# EAGLE design StepDrv (EAGLE 7.2.0)
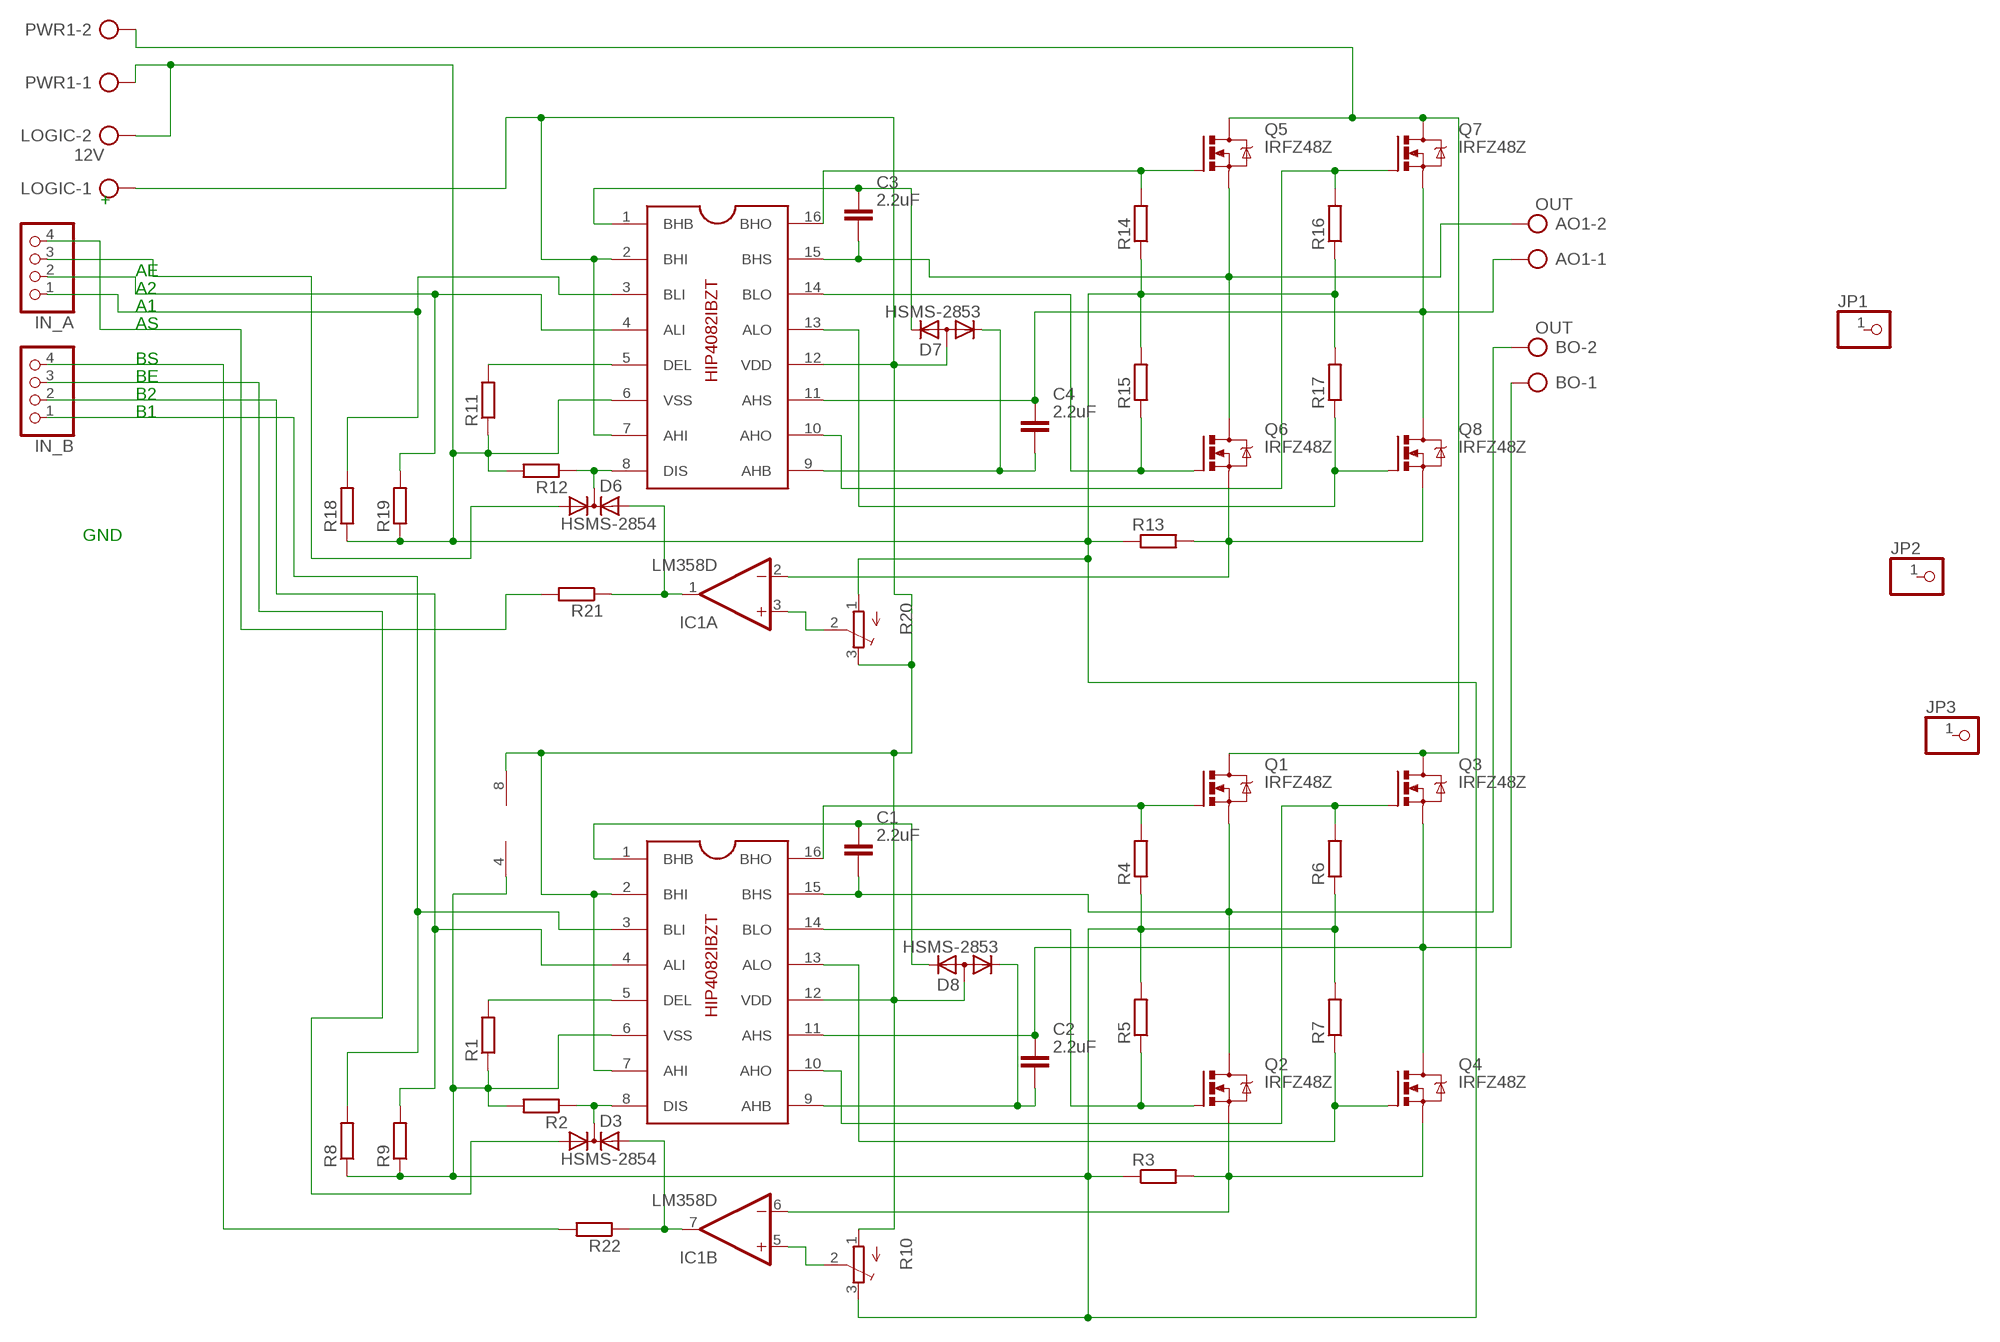
[diagram p0: schematic, sheet 1]

## Parts
AO1  OUT  AK300/2  [AK300/2]
BO  OUT  AK300/2  [AK300/2]
C1  2.2uF  CAPACITOR_NPOL-1206  [C1206]
C2  2.2uF  CAPACITOR_NPOL-1206  [C1206]
C3  2.2uF  CAPACITOR_NPOL-1206  [C1206]
C4  2.2uF  CAPACITOR_NPOL-1206  [C1206]
D3  HSMS-2854  [SOT23]
D6  HSMS-2854  [SOT23]
D7  HSMS-2853  [SOT23]
D8  HSMS-2853  [SOT23]
IC1  LM358D  [SO08]
IN_A  PINHD-1X4  [1X04]
IN_B  PINHD-1X4  [1X04]
JP1  PINHD-1X1  [1X01]
JP2  PINHD-1X1  [1X01]
JP3  PINHD-1X1  [1X01]
LOGIC  12V  AK300/2  [AK300/2]
PWR1  AK300/2  [AK300/2]
Q1  IRFZ48Z  [TO220BH]
Q2  IRFZ48Z  [TO220BH]
Q3  IRFZ48Z  [TO220BH]
Q4  IRFZ48Z  [TO220BH]
Q5  IRFZ48Z  [TO220BH]
Q6  IRFZ48Z  [TO220BH]
Q7  IRFZ48Z  [TO220BH]
Q8  IRFZ48Z  [TO220BH]
R1  R-EU_R1206  [R1206]
R2  R-EU_R1206  [R1206]
R3  R-EU_0922/22  [0922/22]
R4  R-EU_M1206  [M1206]
R5  R-EU_M1206  [M1206]
R6  R-EU_M1206  [M1206]
R7  R-EU_M1206  [M1206]
R8  R-EU_M1206  [M1206]
R9  R-EU_M1206  [M1206]
R10  TRIM_EU-3223G  [3223G]
R11  R-EU_R1206  [R1206]
R12  R-EU_R1206  [R1206]
R13  R-EU_0922/22  [0922/22]
R14  R-EU_M1206  [M1206]
R15  R-EU_M1206  [M1206]
R16  R-EU_M1206  [M1206]
R17  R-EU_M1206  [M1206]
R18  R-EU_M1206  [M1206]
R19  R-EU_M1206  [M1206]
R20  TRIM_EU-3223G  [3223G]
R21  R-EU_M1206  [M1206]
R22  R-EU_M1206  [M1206]
U$1  HIP4082IBZT  [SO16]
U$2  HIP4082IBZT  [SO16]

## Nets
N$2: D3.3(C) R2.1 U$1.8(DIS)
N$3: C1.1 D8.2(K2) U$1.1(BHB)
N$4: BO.2 C1.2 Q1.S Q2.D U$1.15(BHS)
N$5: D3.1(A1) IN_B.3
N$6: R1.2 U$1.5(DEL)
N$7: IN_A.4 R21.2
N$8: BO.1 C2.1 Q3.S Q4.D U$1.11(AHS)
N$9: IN_B.2 R9.2 U$1.4(ALI)
N$10: IN_B.1 R8.2 U$1.3(BLI)
N$11: IC1.6(B:-IN) Q2.S Q4.S R3.2
N$12: Q1.G R4.2 U$1.16(BHO)
N$13: Q2.G R5.1 U$1.14(BLO)
N$14: Q3.G R6.2 U$1.10(AHO)
N$15: Q4.G R7.1 U$1.13(ALO)
N$16: D3.2(A2) IC1.7(B:OUT) R22.1
N$18: IC1.5(B:+IN) R10.2(S)
N$19: C4.2 D7.1(K1) U$2.9(AHB)
N$20: C3.1 D7.2(K2) U$2.1(BHB)
N$21: AO1.2 C3.2 Q5.S Q6.D U$2.15(BHS)
N$22: C2.2 D8.1(K1) U$1.9(AHB)
N$23: D6.1(A1) IN_A.3
N$24: R11.2 U$2.5(DEL)
N$25: AO1.1 C4.1 Q7.S Q8.D U$2.11(AHS)
N$26: IC1.2(A:-IN) Q6.S Q8.S R13.2
N$27: Q5.G R14.2 U$2.16(BHO)
N$28: Q6.G R15.1 U$2.14(BLO)
N$29: Q7.G R16.2 U$2.10(AHO)
N$30: Q8.G R17.1 U$2.13(ALO)
N$31: IN_A.2 R19.2 U$2.4(ALI)
N$32: IN_A.1 R18.2 U$2.3(BLI)
N$33: IN_B.4 R22.2
N$34: D6.3(C) R12.1 U$2.8(DIS)
N$35: D6.2(A2) IC1.1(A:OUT) R21.1
N$36: IC1.3(A:+IN) R20.2(S)
N$37: PWR1.2 Q1.D Q3.D Q5.D Q7.D
N$38: IC1.4(P:V-) LOGIC.2 PWR1.1 R1.1 R2.2 R3.1 R4.1 R5.2 R6.1 R7.2 R8.1 R9.1 R10.3(E) R11.1 R12.2 R13.1 R14.1 R15.2 R16.1 R17.2 R18.1 R19.1 R20.1(A) U$1.6(VSS) U$2.6(VSS)
N$39: D7.3(A) D8.3(A) IC1.8(P:V+) LOGIC.1 R10.1(A) R20.3(E) U$1.2(BHI) U$1.7(AHI) U$1.12(VDD) U$2.2(BHI) U$2.7(AHI) U$2.12(VDD)
Unconnected: JP1.1 JP2.1 JP3.1

## Notes on the sheet
- +
- AE
- A2
- A1
- AS
- BS
- BE
- B2
- B1
- GND

## Library data of the parts
AO1 BO LOGIC PWR1 = con-ptr500:AK300/2: CONNECTOR; OC_FARNELL: unknown; OC_NEWARK: unknown
C1-C4 = dp_devices:CAPACITOR_NPOL: Non-Polarized capacitor in various packages
D3 D6 = avago:HSMS-2854: Surface Mount Microwave Schottky Detector Diodes Source: Data sheet <http://www.farnell.com/datasheets/461166.pdf>
D7 D8 = avago:HSMS-2853: Surface Mount Microwave Schottky Detector Diodes Source: Data sheet <http://www.farnell.com/datasheets/461166.pdf>
IC1 = linear:LM358: OP AMP also LM158; LM258; LM2904 Source: http://cache.national.com/ds/LM/LM158.pdf
IN_A IN_B = pinhead:PINHD-1X4: PIN HEADER
JP1-JP3 = pinhead:PINHD-1X1: PIN HEADER
Q1-Q8 = transistor-power:IRFZ48: N Channel HEXFET® Power MOSFET Logic Level Source: http://www.irf.com/product-info/datasheets/data/irfz48z.pdf
R1-R9 R11-R19 R21 R22 = rcl:R-EU_: RESISTOR, European symbol
R10 R20 = pot:TRIM_EU-: POTENTIOMETER
U$1 U$2 = mosfet_drivers:HIP4082IBZT: HIP4082IBZT Тип драйвера сдвоенный драйвер полумоста Время задержки, нс 75 Диапазон рабочих напряжений, В 10…20 Диапазон рабочих температур, С -55…+125 Тип входа неинвертирующий Количество нижних каналов 2 Количество верхних каналов 2 Максимальное напряжение смещения, В 95 Максимальный выходной ток нарастания/спада 1.4/1.4 Корпус so16

## Board
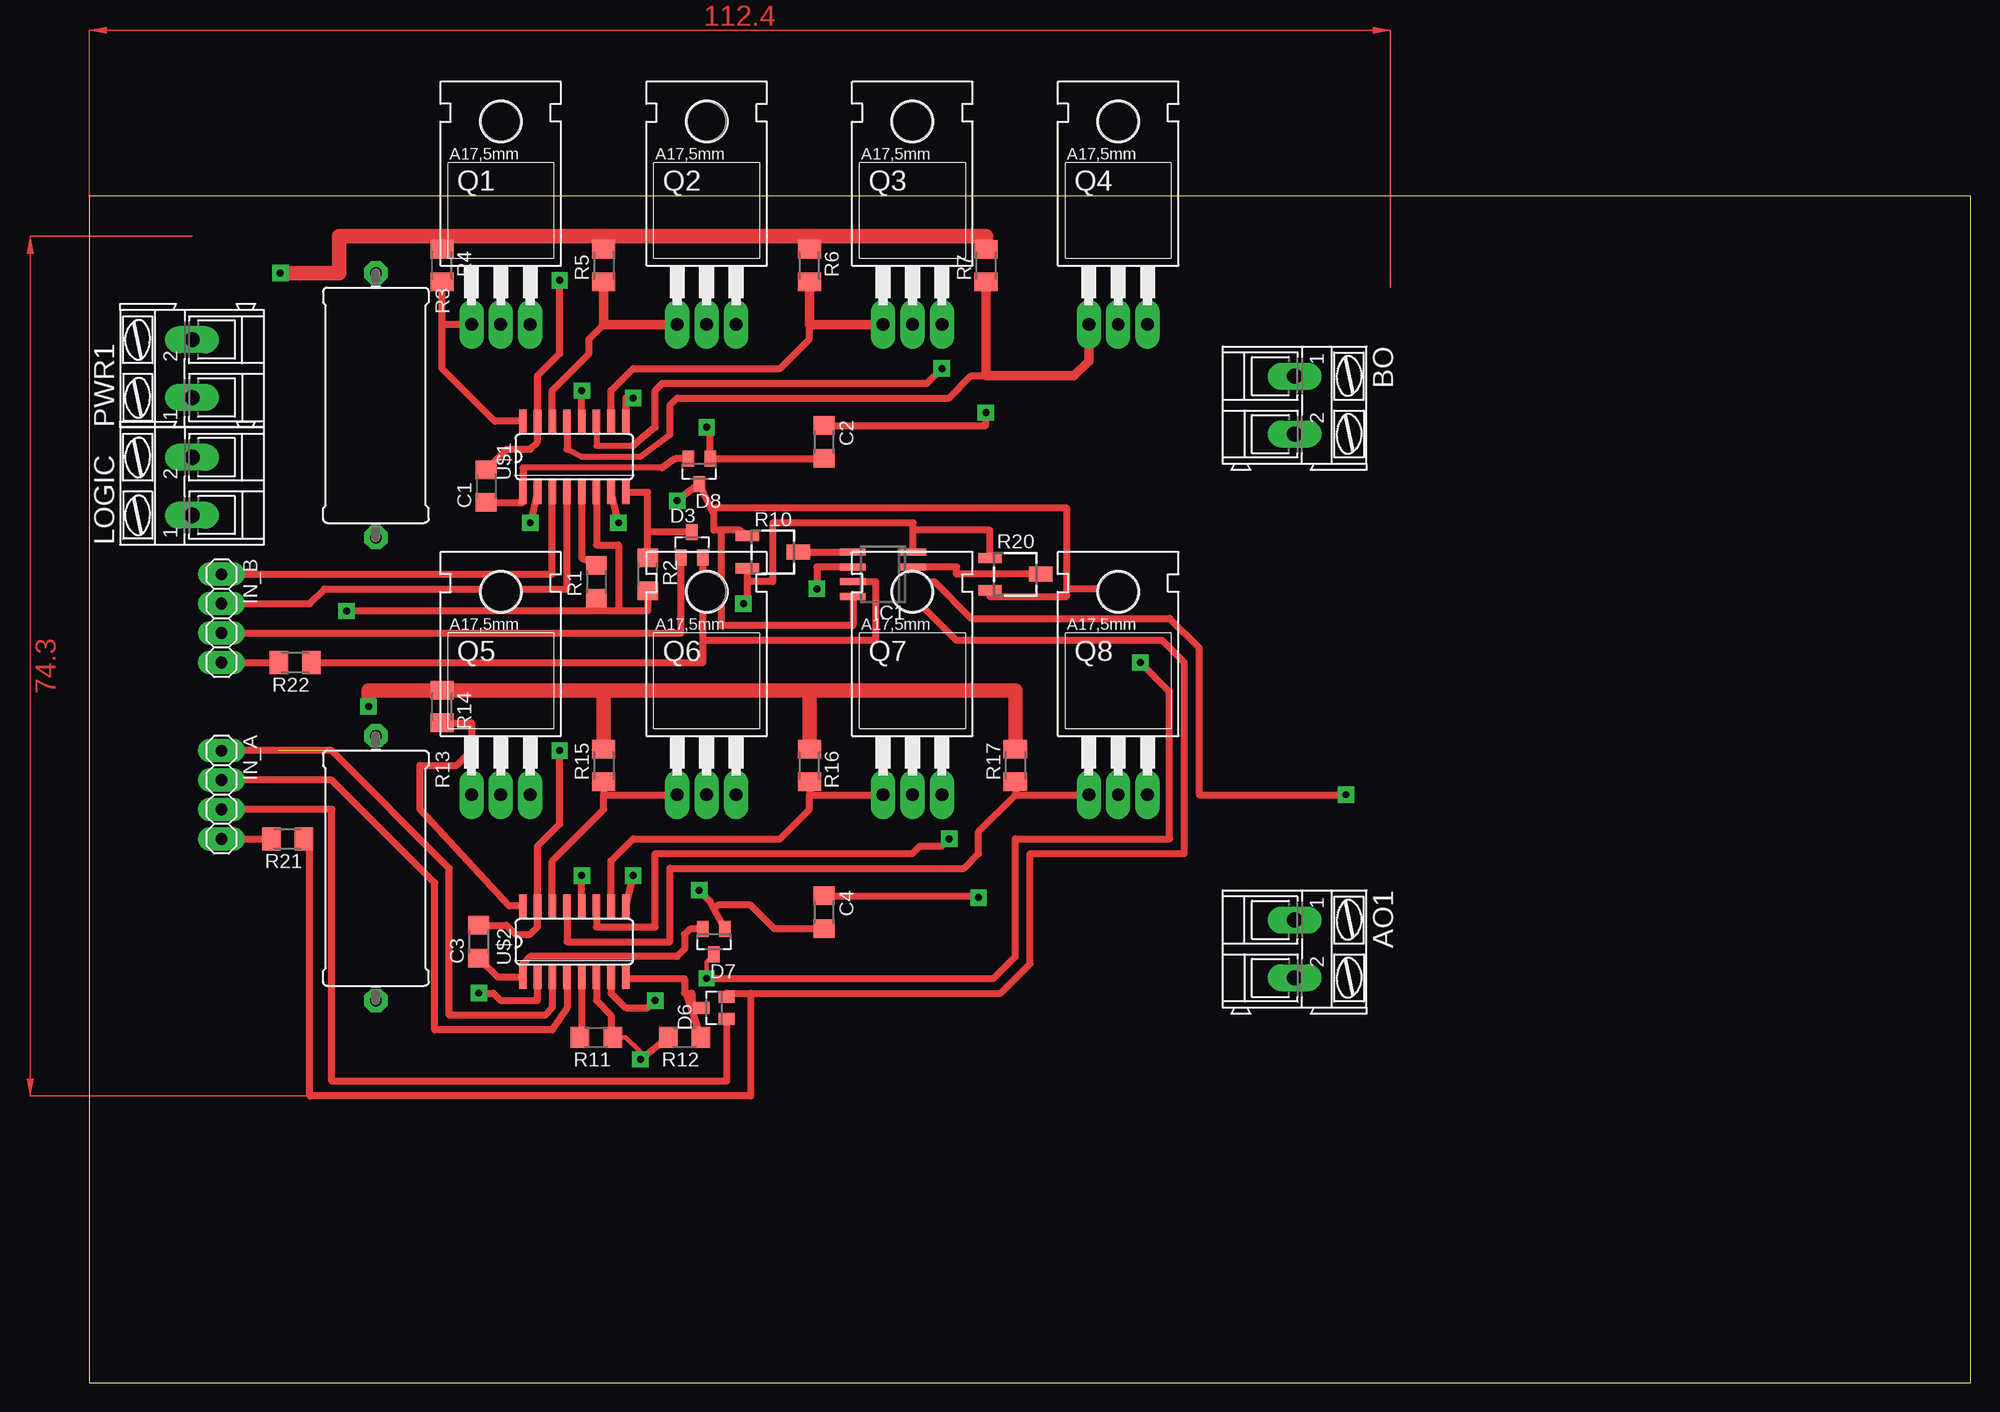
[diagram p1: board, top side]
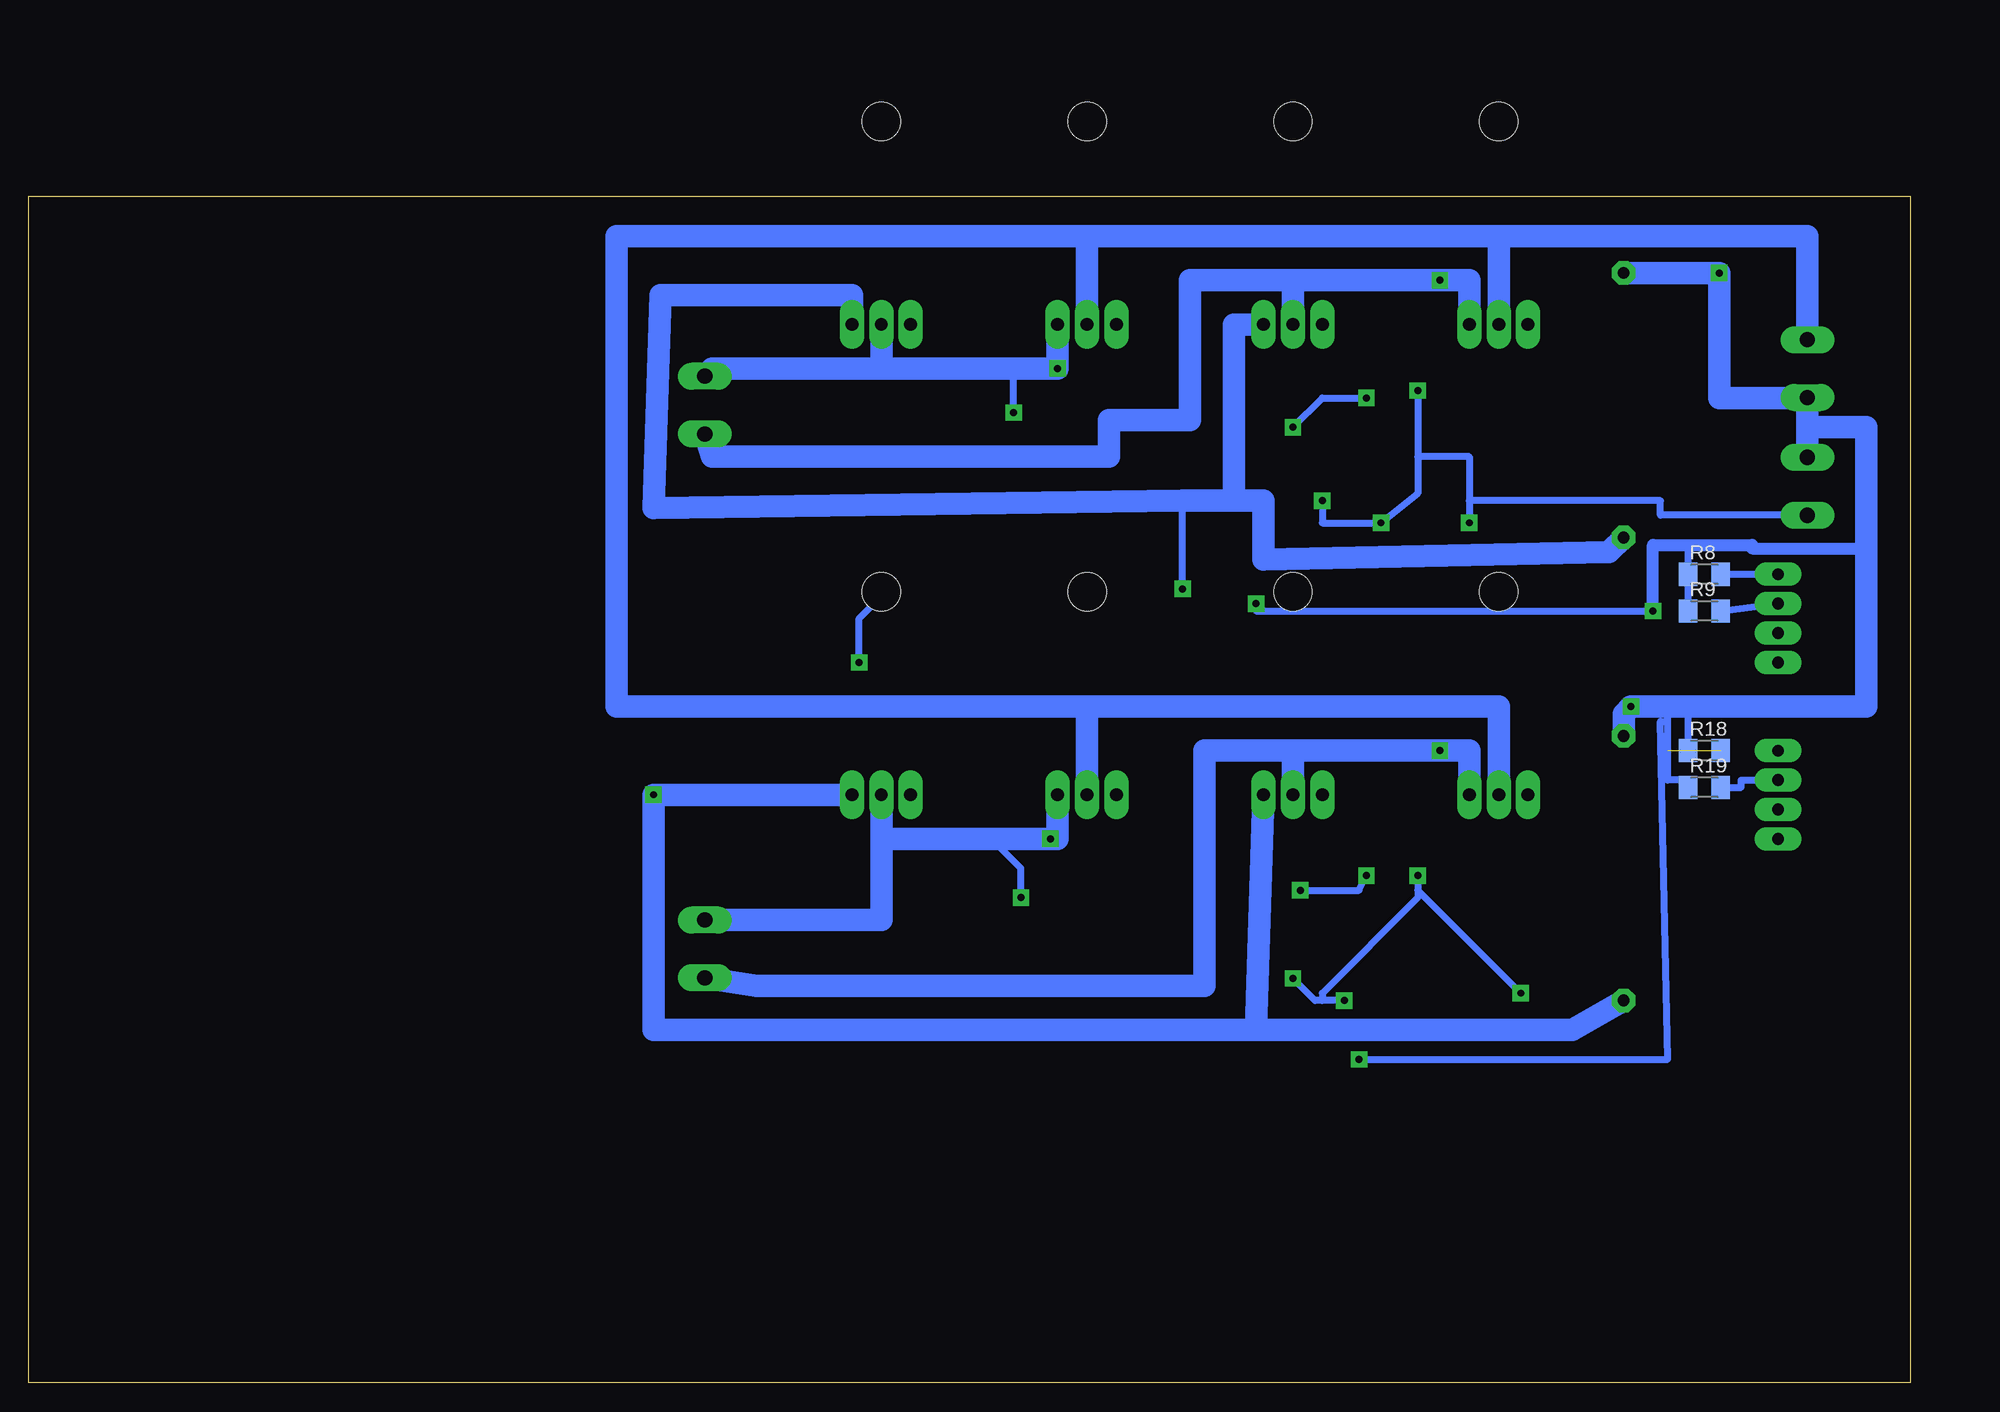
[diagram p2: board, bottom side, seen from below]

Size 162.54 x 102.54 mm. Coordinates in mm from the lower left corner, seen from the top.
Outline: 0,0 162.54,0 162.54,102.54 0,102.54 0,0
Copper layers (1*16): Top 0.035mm / dielectric 1.5mm / Bottom 0.035mm
Design rules "default *": minimum track width 10mil, minimum drill 24mil, track to track 8mil, track to pad 8mil, pad to pad 8mil, via to via 8mil, smd to smd 8mil, copper to edge 40mil, drill to drill 8mil, minimum pad ring 20mil, minimum via ring 16mil, stop-mask expansion 4mil, vias tented up to drill 0mil, thermal gap 10mil

### Footprints (pad centres in the part's own frame; a part is rotated, then mirrored left to right if it is on the bottom)
AK300/2 = drill 1.321 long: 1 -2.515,0; 2 2.489,0
C1206 = smd 1.6 x 1.803: 1 -1.422,0; 2 1.422,0
SOT23 = smd 1 x 1.4: 1 -0.95,-1.1; 2 0.95,-1.1; 3 0,1.1
SO08 = smd 0.6 x 2.2: 1 -1.905,-2.6; 2 -0.635,-2.6; 3 0.635,-2.6; 4 1.905,-2.6; 5 1.905,2.6; 6 0.635,2.6; 7 -0.635,2.6; 8 -1.905,2.6
1X04 = drill 1.016 long: 1 -3.81,0; 2 -1.27,0; 3 1.27,0; 4 3.81,0
1X01 = drill 1.016 octagon: 1 0,0
TO220BH = drill 1.118 long: D 0,-6.35; G -2.54,-6.35; S 2.54,-6.35 | hole 3.302: 0,11.176
R1206 = smd 1.6 x 1.803: 1 -1.422,0; 2 1.422,0
0922/22 = drill 1.016 octagon: 1 -11.43,0; 2 11.43,0
M1206 = smd 1.6 x 2: 1 -1.4,0; 2 1.4,0
3223G = smd 2 x 0.9: 1 -2.2,1.4; 3 -2.2,-1.4 | smd 2 x 1.3: 2 2.2,0
SO16 = smd 0.66 x 2.032: 1 -4.445,-3.073; 2 -3.175,-3.073; 3 -1.905,-3.073; 4 -0.635,-3.073; 5 0.635,-3.073; 6 1.905,-3.073; 7 3.175,-3.073; 8 4.445,-3.073; 9 4.445,3.073; 10 3.175,3.073; 11 1.905,3.073; 12 0.635,3.073; 13 -0.635,3.073; 14 -1.905,3.073; 15 -3.175,3.073; 16 -4.445,3.073

### Placement (x,y rotation side)
AO1  104.14,37.47 270 top
BO  104.14,84.45 270 top
C1  34.29,77.47 90 top
C2  63.5,81.28 270 top
C3  33.66,38.1 90 top
C4  63.5,40.64 270 top
D3  52.07,72.39 0 top
D6  53.98,32.38 90 top
D7  53.98,38.1 180 top
D8  52.7,78.74 180 top
IC1  68.58,69.85 90 top
IN_A  11.43,50.8 270 top
IN_B  11.43,66.04 270 top
JP1  -107.95,-11.43 0 top  (outside the outline)
JP2  -107.95,-16.51 0 top  (outside the outline)
JP3  -107.95,-21.59 0 top  (outside the outline)
LOGIC  8.89,77.47 90 top
PWR1  8.89,87.63 90 top
Q1  35.56,97.79 0 top
Q2  53.34,97.79 0 top
Q3  71.12,97.79 0 top
Q4  88.9,97.79 0 top
Q5  35.56,57.15 0 top
Q6  53.34,57.15 0 top
Q7  71.12,57.15 0 top
Q8  88.9,57.15 0 top
R1  43.81,69.22 90 top
R2  48.26,69.85 270 top
R3  24.77,84.45 270 top
R4  30.48,96.52 270 top
R5  44.45,96.52 90 top
R6  62.23,96.52 270 top
R7  77.47,96.52 90 top
R8  17.78,69.85 0 bottom
R9  17.78,66.67 0 bottom
R10  59.05,71.75 0 top
R11  43.81,29.84 180 top
R12  51.44,29.84 180 top
R13  24.77,44.45 270 top
R14  30.48,58.42 270 top
R15  44.45,53.34 90 top
R16  62.23,53.34 270 top
R17  80.01,53.34 90 top
R18  17.78,54.61 0 bottom
R19  17.78,51.44 0 bottom
R20  80.01,69.85 0 top
R21  17.14,46.99 180 top
R22  17.78,62.23 180 top
U$1  41.91,80.01 0 top
U$2  41.91,38.1 0 top

### Tracks (layer width: path | path; a pad name or v marks a point on that pad's centre or on a via)
N$2
  Top 0.61: U$1.8 48.26,76.94 48.26,73.66 48.26,73.49 | R2.1 48.26,73.49 | D3.3 48.26,73.49
N$3
  Top 0.508: 49.53,79.06 37.46,79.06
  Top 0.61: D8.2 50.63,79.84 49.53,79.06 | 37.46,79.06 U$1.1 37.46,76.05 C1.1
N$4  (via drill 0.6)
  Top 0.61: v40.64,95.25 40.64,88.9 38.73,87 U$1.15 38.73,81.28 38.1,80.64 36.04,80.64 C1.2
  Bottom 1.93: BO.2 103.51,80.01 69.22,80.01 69.22,83.19 62.23,83.19 62.23,95.25 53.34,95.25 | 53.34,95.25 v40.64,95.25 38.1,95.25 Q1.S | Q2.D 53.34,95.25
N$5
  Top 0.61: D3.1 51.12,64.77 IN_B.3
N$6
  Top 0.61: U$1.5 42.55,71.27 R1.2
N$7
  Top 0.61: IN_A.4 R21.2
N$8  (via drill 0.6)
  Top 0.508: U$1.11 43.81,80.96 46.99,80.96
  Top 0.61: 46.99,80.96 48.89,82.55 48.89,85.72 49.53,86.36 72.39,86.36 v73.66,87.63 | C2.1 77.47,82.7 v77.47,83.82
  Bottom 0.61: v77.47,83.82 77.47,87.63
  Bottom 1.93: BO.1 103.51,87.61 88.9,87.63 | 88.9,87.63 77.47,87.63 v73.66,87.63 Q3.S | Q4.D 88.9,87.63
N$9
  Top 0.61: U$1.4 41.27,68.58 20.32,68.58 19.05,67.31 IN_B.2
  Bottom 0.61: R9.2 IN_B.2
N$10
  Top 0.61: U$1.3 40.01,69.85 IN_B.1
  Bottom 0.61: R8.2 IN_B.1
N$11  (via drill 0.6)
  Top 0.61: IC1.6 62.87,70.48 v62.87,68.58
  Bottom 0.61: v62.87,68.58 62.87,76.2
  Bottom 1.93: R3.2 26.04,71.75 55.88,71.12 55.88,76.2 58.42,76.2 | 58.42,76.2 58.42,91.44 Q2.S | Q4.S 91.44,93.98 107.95,93.98 108.59,75.56 62.87,76.2 58.42,76.2
N$12
  Top 0.61: U$1.16 35.03,83.08 30.48,87.63 30.48,91.44 | 30.48,91.44 R4.2 | Q1.G 30.48,91.44
N$13
  Top 0.61: U$1.14 40.01,85.72 43.18,88.9 43.18,90.17 44.45,91.44
  Top 0.813: R5.1 44.45,91.44 Q2.G
N$14
  Top 0.61: U$1.10 45.09,85.72 46.99,87.63 59.69,87.63 62.23,90.17 62.23,91.44
  Top 0.813: R6.2 62.23,91.44 Q3.G
N$15
  Top 0.508: 41.27,80.64 42.55,80.01 47.62,80.01 50.16,81.92
  Top 0.61: U$1.13 41.27,80.64 | 50.16,81.92 50.16,84.45 50.8,85.09 74.3,85.09 76.2,87 77.47,87
  Top 0.813: R7.1 77.47,87 85.09,87 86.36,88.27 Q4.G
N$16
  Top 0.61: R22.1 53.02,62.23 53.02,64.14 | 53.02,64.14 D3.2 | IC1.7 67.95,69.22 67.95,64.14 53.02,64.14
N$18
  Top 0.61: R10.2 IC1.5
N$19  (via drill 0.6)
  Top 0.61: D7.1 54,40.95 | 54,40.95 53.66,41.59 v52.7,42.55 | v46.99,43.81 U$2.9 | C4.2 59.21,39.22 57.15,41.27 54.32,41.27 54,40.95
  Bottom 0.61: v52.7,42.55 47.62,42.55 v46.99,43.81
N$20
  Top 0.61: C3.1 35.31,35.03 U$2.1 37.46,36.2 38.1,36.83 50.8,36.83 51.44,37.47 51.44,38.73 51.9,39.2 D7.2
N$21  (via drill 0.6)
  Top 0.61: v40.64,54.61 40.64,48.26 38.73,46.35 U$2.15 38.73,39.37 38.1,38.73 36.83,38.73 36.04,39.52 C3.2
  Bottom 1.93: Q5.S 38.1,54.61 v40.64,54.61 53.34,54.61 | 53.34,54.61 60.96,54.61 60.96,34.29 99.7,34.29 AO1.2 | Q6.D 53.34,54.61
N$22  (via drill 0.6)
  Top 0.61: C2.2 63.5,79.84 D8.1 53.66,82.23 v53.34,82.55 | v46.99,85.09 46.35,85.09 U$1.9
  Bottom 0.61: v53.34,82.55 50.8,85.09 v46.99,85.09
N$23
  Top 0.61: D6.1 55.07,26.04 20.95,26.04 20.95,49.53 IN_A.3
N$24
  Top 0.61: U$2.5 42.55,30 R11.2
N$25  (via drill 0.6)
  Top 0.61: U$2.11 43.81,39.37 48.89,39.37 48.89,45.72 71.12,45.72 71.76,46.35 73.66,46.35 v74.3,46.99 | C4.1 76.68,42.06 v76.84,41.91
  Bottom 0.61: v76.84,41.91 76.84,44.45 79.38,46.99
  Bottom 1.93: Q8.D 88.9,46.99 | 88.9,46.99 88.9,39.98 AO1.1 | Q7.S 73.66,46.99 v74.3,46.99 79.38,46.99 88.9,46.99
N$26  (via drill 0.6)
  Top 0.61: IC1.2 73.03,69.22 76.2,66.04 93.35,66.04 95.89,63.5 95.89,50.8 v108.59,50.8
  Bottom 1.93: R13.2 29.21,30.48 56.52,30.48 | 56.52,30.48 Q6.S | Q8.S v108.59,50.8 108.59,30.48 56.52,30.48
N$27
  Top 0.61: R14.2 33.02,57.02 33.02,54.61 | 33.02,54.61 Q5.G | U$2.16 36.3,41.17 28.57,49.53 28.57,53.34 31.75,53.34 33.02,54.61
N$28
  Top 0.61: R15.1 44.45,50.8 | 44.45,50.8 Q6.G | 44.45,50.8 44.45,49.53 40.01,45.09 U$2.14
N$29
  Top 0.61: R16.2 62.23,50.8 | 62.23,50.8 Q7.G | U$2.10 45.09,45.09 46.99,46.99 59.69,46.99 62.23,49.53 62.23,50.8
N$30
  Top 0.61: R17.1 80.01,50.8 | 80.01,50.8 Q8.G | U$2.13 41.27,38.1 50.16,38.1 50.16,44.45 75.57,44.45 76.84,45.72 76.84,47.62 80.01,50.8
N$31
  Top 0.61: U$2.4 41.27,32.38 40.01,30.48 29.84,30.48 29.84,43.18 20.95,52.07 IN_A.2
  Bottom 0.61: R19.2 14.61,51.44 14.61,52.07 IN_A.2
N$32  (1 unrouted)
  Top 0.61: IN_A.1 20.95,54.61 31.11,44.45 31.11,31.75 39.37,31.75 40.01,32.38 U$2.3
N$33
  Top 0.61: IN_B.4 R22.2
N$34
  Top 0.61: 51.59,33.66 52.07,33.66 52.07,32.38 D6.3 | R12.1 51.59,33.66 | 51.59,33.66 51.44,33.66 51.44,34.92 46.35,34.92 U$2.8
N$35
  Top 0.61: D6.2 55.07,33.66 57.15,33.66 | 57.15,33.66 57.15,24.77 19.05,24.77 19.05,46.99 R21.1 | 57.15,33.66 78.74,33.66 81.28,36.2 81.28,45.72 94.62,45.72 94.62,62.23 92.71,64.14 74.93,64.14 71.18,67.89 IC1.1
N$36
  Top 0.61: R20.2 74.93,69.85 74.93,70.48 IC1.3
N$37
  Bottom 1.93: PWR1.2 8.89,99.06 35.56,99.06 | 35.56,99.06 71.12,99.06 | 71.12,99.06 Q3.D | Q1.D 35.56,99.06 | Q7.D 71.12,58.42 | 71.12,58.42 111.76,58.42 111.76,99.06 71.12,99.06 | Q5.D 35.56,58.42 71.12,58.42
N$38  (via drill 0.6)
  Top 0.406: v47.62,27.94 47.62,28.57 46.35,29.84 R11.1
  Top 0.61: R1.1 43.81,66.67 | 43.81,66.67 v22.22,66.67 | U$1.6 43.81,72.39 45.72,72.39 45.72,66.67 | 45.72,66.67 43.81,66.67 | R2.2 48.26,66.67 45.72,66.67 | R10.3 56.85,69.22 | 56.85,69.22 56.85,67.31 v56.52,67.31 | IC1.4 71.18,73.66 | 71.18,73.66 71.18,74.3 59.05,74.3 59.05,69.22 56.85,69.22 | R20.1 77.81,73.66 71.18,73.66 | U$2.6 43.81,33.02 45.09,31.75 45.09,30 R11.1 | R12.2 v47.62,27.94
  Top 1.27: R4.1 30.48,99.06 | 30.48,99.06 21.59,99.06 21.59,95.89 v16.51,95.89 | R5.2 44.45,99.06 | 44.45,99.06 30.48,99.06 | R6.1 62.23,99.06 | 62.23,99.06 44.45,99.06 | R7.2 77.47,99.06 62.23,99.06 | v24.13,58.42 24.13,59.82 R14.1 44.45,59.82 | R17.2 80.01,59.82 62.23,59.82 | 62.23,59.82 44.45,59.82 | R15.2 44.45,59.82 | R16.1 62.23,59.82
  Bottom 0.61: R9.1 R8.1 19.18,72.39 22.22,72.39 | v56.52,67.31 56.52,66.67 v22.22,66.67 | R18.1 19.18,57.78 19.68,57.78 19.68,58.42 | R19.1 19.18,52.07 20.95,52.07 20.95,57.15 | 20.95,57.15 20.95,58.42 | v47.62,27.94 20.95,27.94 21.59,57.15 20.95,57.15
  Bottom 1.016: v22.22,66.67 22.22,72.39 13.65,72.39 13.65,72.07 3.81,72.07
  Bottom 1.93: 8.89,82.55 PWR1.1 8.89,85.09 16.51,85.09 v16.51,95.89 R3.1 | 8.89,82.55 LOGIC.2 | 8.89,82.55 3.81,82.55 3.81,72.07 3.81,58.42 19.68,58.42 20.95,58.42 v24.13,58.42 24.77,57.78 R13.1
N$39  (via drill 0.6)
  Top 0.406: v53.34,34.92 53.34,36.37 D7.3
  Top 0.61: U$1.12 v42.55,85.72 | v45.72,74.3 U$1.7 | U$1.2 v38.1,74.3 | R10.1 56.22,73.66 54.61,73.66 | 54.61,73.66 53.98,73.66 53.98,74.93 | 53.98,74.93 53.98,75.56 84.46,75.56 84.46,68.58 | IC1.8 65.98,65.41 54.61,65.41 54.61,73.66 | R20.3 77.81,67.94 84.46,67.94 84.46,68.58 | 53.98,74.93 D8.3 v50.8,76.2 | U$2.7 45.09,33.66 46.35,32.38 48.26,32.38 v48.89,33.02 | U$2.12 v42.55,43.81 | v33.66,33.66 34.92,33.66 35.56,33.02 38.73,33.02 U$2.2 | v53.34,34.92 78.11,34.92 80.01,36.83 80.01,46.99 93.35,46.99 93.35,59.69 v90.81,62.23 | v88.27,68.58 84.46,68.58
  Bottom 0.61: v42.55,85.72 42.55,80.01 | 42.55,80.01 42.55,76.83 v45.72,74.3 50.8,74.3 v50.8,76.2 | 42.55,80.01 38.1,80.01 38.1,76.2 | 38.1,76.2 v38.1,74.3 | LOGIC.1 21.59,74.95 21.59,76.2 38.1,76.2 | v48.89,33.02 50.8,33.02 | 50.8,33.02 51.44,33.02 v53.34,34.92 | 42.55,42.55 42.55,41.91 50.8,33.66 50.8,33.02 | v42.55,43.81 42.55,42.55 | 42.55,42.55 v33.66,33.66 | v90.81,62.23 90.81,66.04 v88.27,68.58
(copper drawn outside any net)
  shapes: Top area x2